# EAGLE design schema_mpb1_1_IO (EAGLE 9.0.1)

## Sheet 1 of 3: INPUTS
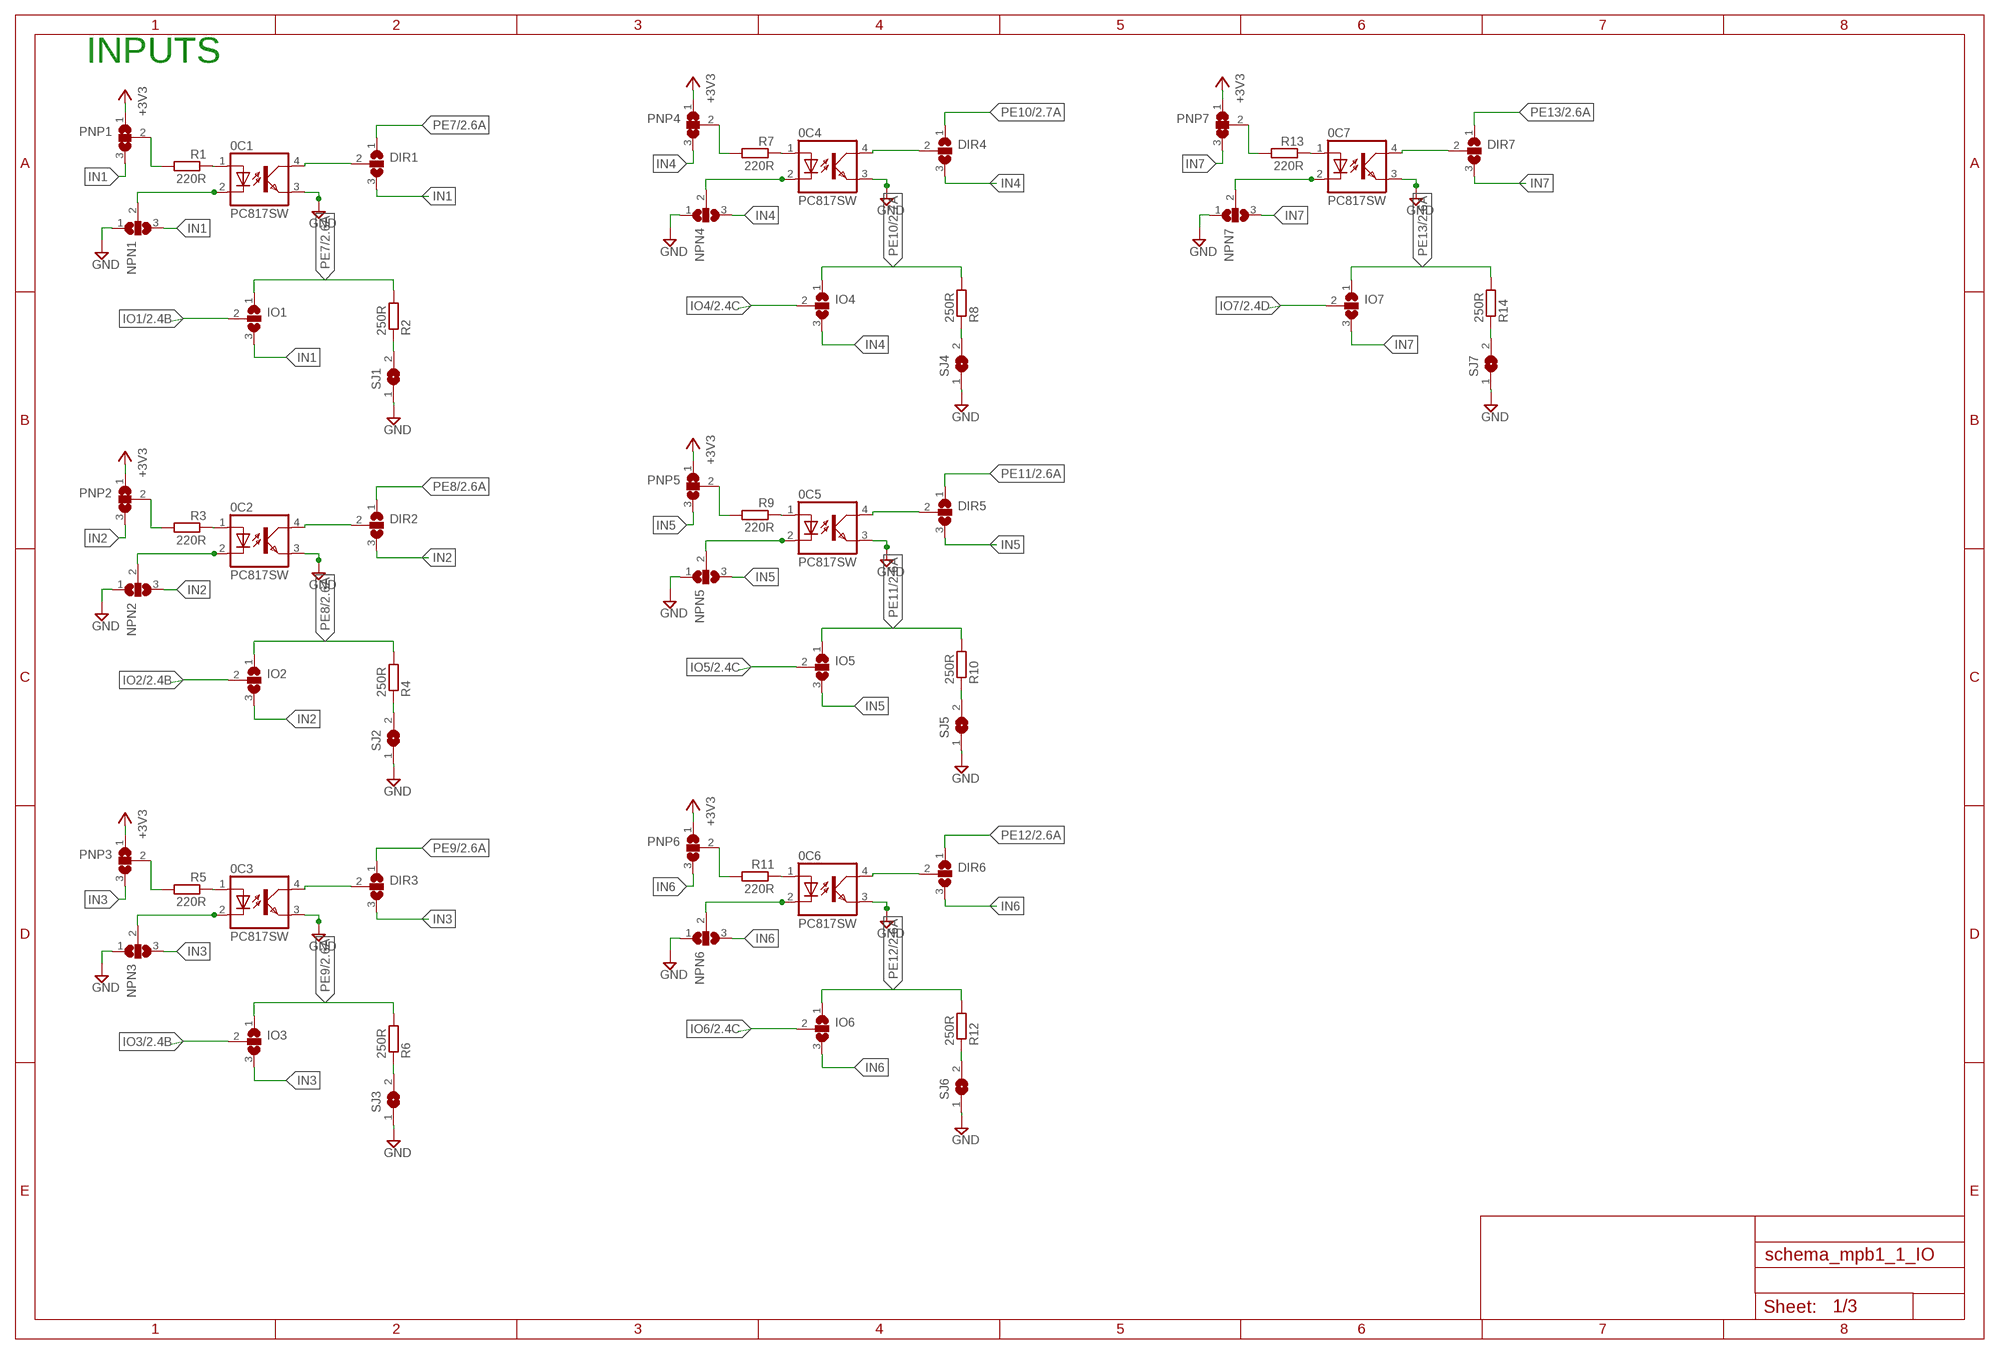
[diagram p0: schematic, sheet 1]

### Parts
0C1  PC817SW  [PC817SMTW]
0C2  PC817SW  [PC817SMTW]
0C3  PC817SW  [PC817SMTW]
0C4  PC817SW  [PC817SMTW]
0C5  PC817SW  [PC817SMTW]
0C6  PC817SW  [PC817SMTW]
0C7  PC817SW  [PC817SMTW]
DIR1  SJ2W  [SJ_2]
DIR2  SJ2W  [SJ_2]
DIR3  SJ2W  [SJ_2]
DIR4  SJ2W  [SJ_2]
DIR5  SJ2W  [SJ_2]
DIR6  SJ2W  [SJ_2]
DIR7  SJ2W  [SJ_2]
IO1  SJ2W  [SJ_2]
IO2  SJ2W  [SJ_2]
IO3  SJ2W  [SJ_2]
IO4  SJ2W  [SJ_2]
IO5  SJ2W  [SJ_2]
IO6  SJ2W  [SJ_2]
IO7  SJ2W  [SJ_2]
NPN1  SJ2W  [SJ_2]
NPN2  SJ2W  [SJ_2]
NPN3  SJ2W  [SJ_2]
NPN4  SJ2W  [SJ_2]
NPN5  SJ2W  [SJ_2]
NPN6  SJ2W  [SJ_2]
NPN7  SJ2W  [SJ_2]
PNP1  SJ2W  [SJ_2]
PNP2  SJ2W  [SJ_2]
PNP3  SJ2W  [SJ_2]
PNP4  SJ2W  [SJ_2]
PNP5  SJ2W  [SJ_2]
PNP6  SJ2W  [SJ_2]
PNP7  SJ2W  [SJ_2]
R1  220R  R-EU_R0603  [R0603]
R2  250R  R-EU_R0603  [R0603]
R3  220R  R-EU_R0603  [R0603]
R4  250R  R-EU_R0603  [R0603]
R5  220R  R-EU_R0603  [R0603]
R6  250R  R-EU_R0603  [R0603]
R7  220R  R-EU_R0603  [R0603]
R8  250R  R-EU_R0603  [R0603]
R9  220R  R-EU_R0603  [R0603]
R10  250R  R-EU_R0603  [R0603]
R11  220R  R-EU_R0603  [R0603]
R12  250R  R-EU_R0603  [R0603]
R13  220R  R-EU_R0603  [R0603]
R14  250R  R-EU_R0603  [R0603]
SJ1  SJ  [SJ]
SJ2  SJ  [SJ]
SJ3  SJ  [SJ]
SJ4  SJ  [SJ]
SJ5  SJ  [SJ]
SJ6  SJ  [SJ]
SJ7  SJ  [SJ]

### Nets
+3V3: PNP1.1 PNP2.1 PNP3.1 PNP4.1 PNP5.1 PNP6.1 PNP7.1 ; also sheet 2
GND: 0C1.3(EMIT) 0C2.3(EMIT) 0C3.3(EMIT) 0C4.3(EMIT) 0C5.3(EMIT) 0C6.3(EMIT) 0C7.3(EMIT) NPN1.1 NPN2.1 NPN3.1 NPN4.1 NPN5.1 NPN6.1 NPN7.1 SJ1.1 SJ2.1 SJ3.1 SJ4.1 SJ5.1 SJ6.1 SJ7.1 ; also sheet 2
IN1: DIR1.3 IO1.3 NPN1.3 PNP1.3
IN2: DIR2.3 IO2.3 NPN2.3 PNP2.3
IN3: DIR3.3 IO3.3 NPN3.3 PNP3.3
IN4: DIR4.3 IO4.3 NPN4.3 PNP4.3
IN5: DIR5.3 IO5.3 NPN5.3 PNP5.3
IN6: DIR6.3 IO6.3 NPN6.3 PNP6.3
IN7: DIR7.3 IO7.3 NPN7.3 PNP7.3
IO1: IO1.2 ; also sheet 2
IO2: IO2.2 ; also sheet 2
IO3: IO3.2 ; also sheet 2
IO4: IO4.2 ; also sheet 2
IO5: IO5.2 ; also sheet 2
IO6: IO6.2 ; also sheet 2
IO7: IO7.2 ; also sheet 2
N$1: PNP1.2 R1.2
N$2: R2.1 SJ1.2
N$3: PNP2.2 R3.2
N$4: 0C2.1(A) R3.1
N$5: 0C2.2(C) NPN2.2
N$6: 0C2.4(COL) DIR2.2
N$7: R4.1 SJ2.2
N$8: PNP3.2 R5.2
N$9: 0C3.1(A) R5.1
N$10: 0C3.2(C) NPN3.2
N$11: 0C3.4(COL) DIR3.2
N$12: R6.1 SJ3.2
N$13: PNP4.2 R7.2
N$14: 0C4.1(A) R7.1
N$15: 0C4.2(C) NPN4.2
N$16: 0C4.4(COL) DIR4.2
N$17: R8.1 SJ4.2
N$18: PNP5.2 R9.2
N$19: 0C5.1(A) R9.1
N$20: 0C5.2(C) NPN5.2
N$21: 0C5.4(COL) DIR5.2
N$22: R10.1 SJ5.2
N$23: PNP6.2 R11.2
N$24: 0C6.1(A) R11.1
N$25: 0C6.2(C) NPN6.2
N$26: 0C6.4(COL) DIR6.2
N$27: R12.1 SJ6.2
N$28: PNP7.2 R13.2
N$29: 0C7.1(A) R13.1
N$30: 0C7.2(C) NPN7.2
N$31: 0C1.1(A) R1.1
N$32: 0C7.4(COL) DIR7.2
N$33: 0C1.2(C) NPN1.2
N$34: R14.1 SJ7.2
N$47: 0C1.4(COL) DIR1.2
PE7: DIR1.1 IO1.1 R2.2 ; also sheet 2
PE8: DIR2.1 IO2.1 R4.2 ; also sheet 2
PE9: DIR3.1 IO3.1 R6.2 ; also sheet 2
PE10: DIR4.1 IO4.1 R8.2 ; also sheet 2
PE11: DIR5.1 IO5.1 R10.2 ; also sheet 2
PE12: DIR6.1 IO6.1 R12.2 ; also sheet 2
PE13: DIR7.1 IO7.1 R14.2 ; also sheet 2

### Notes on the sheet
- INPUTS

## Sheet 2 of 3: OUTPUTS
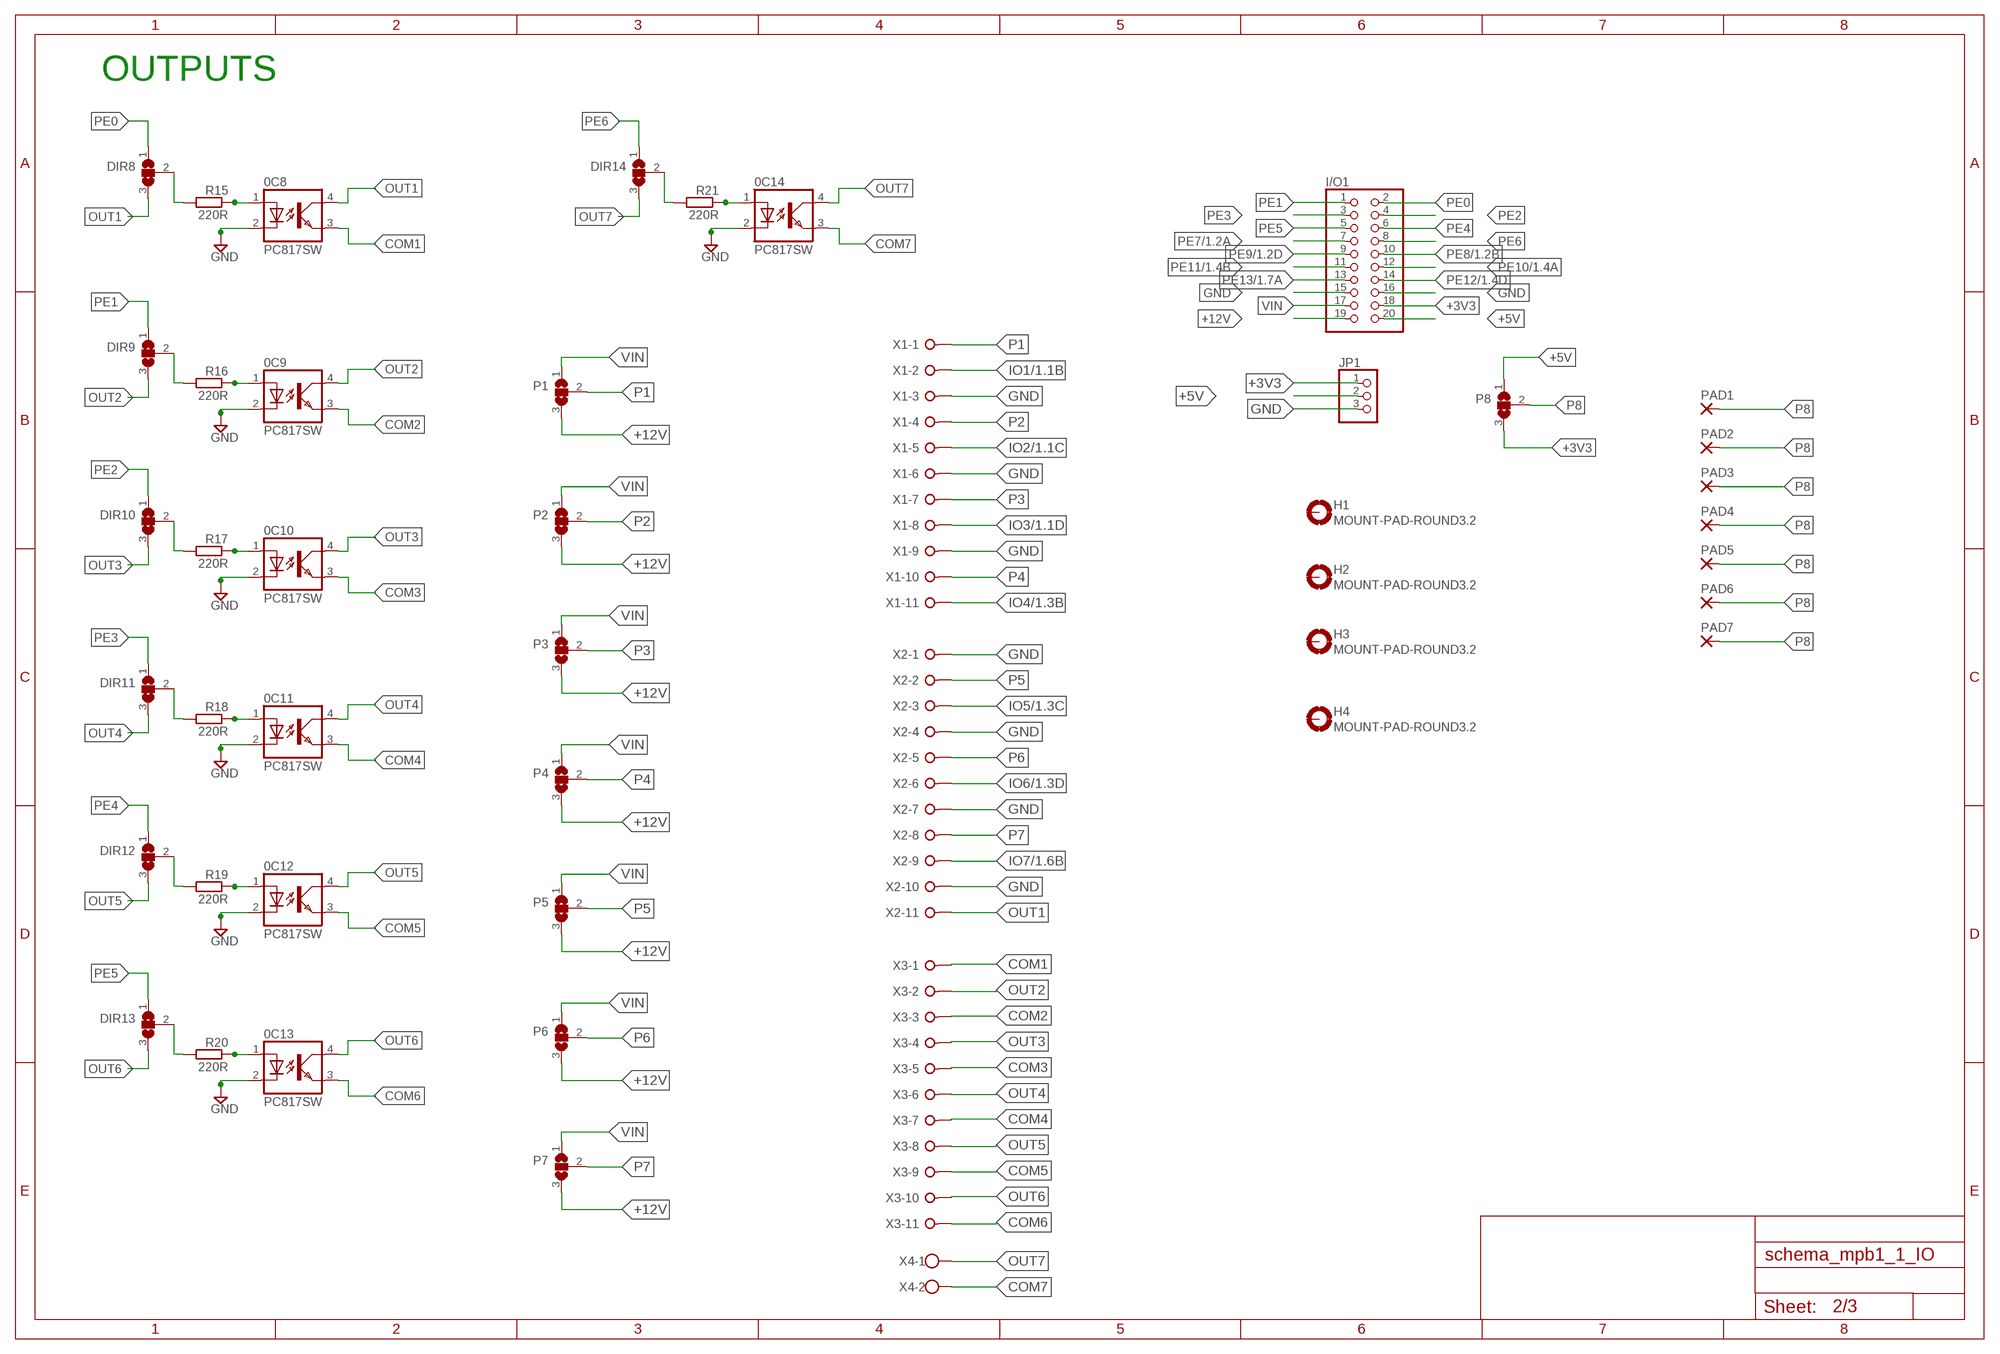
[diagram p1: schematic, sheet 2]

### Parts
0C8  PC817SW  [PC817SMTW]
0C9  PC817SW  [PC817SMTW]
0C10  PC817SW  [PC817SMTW]
0C11  PC817SW  [PC817SMTW]
0C12  PC817SW  [PC817SMTW]
0C13  PC817SW  [PC817SMTW]
0C14  PC817SW  [PC817SMTW]
DIR8  SJ2W  [SJ_2]
DIR9  SJ2W  [SJ_2]
DIR10  SJ2W  [SJ_2]
DIR11  SJ2W  [SJ_2]
DIR12  SJ2W  [SJ_2]
DIR13  SJ2W  [SJ_2]
DIR14  SJ2W  [SJ_2]
H1  MOUNT-PAD-ROUND3.2  [3,2-PAD]
H2  MOUNT-PAD-ROUND3.2  [3,2-PAD]
H3  MOUNT-PAD-ROUND3.2  [3,2-PAD]
H4  MOUNT-PAD-ROUND3.2  [3,2-PAD]
I/O1  PINHD-2X10_2.54  [2X10]
JP1  PINHD-1X3  [1X03]
P1  SJ2WW  [SJ_2W]
P2  SJ2WW  [SJ_2W]
P3  SJ2WW  [SJ_2W]
P4  SJ2WW  [SJ_2W]
P5  SJ2WW  [SJ_2W]
P6  SJ2WW  [SJ_2W]
P7  SJ2WW  [SJ_2W]
P8  SJ2WW  [SJ_2W]
PAD1  SMD2  [SMD1,27-2,54]
PAD2  SMD2  [SMD1,27-2,54]
PAD3  SMD2  [SMD1,27-2,54]
PAD4  SMD2  [SMD1,27-2,54]
PAD5  SMD2  [SMD1,27-2,54]
PAD6  SMD2  [SMD1,27-2,54]
PAD7  SMD2  [SMD1,27-2,54]
R15  220R  R-EU_R0603  [R0603]
R16  220R  R-EU_R0603  [R0603]
R17  220R  R-EU_R0603  [R0603]
R18  220R  R-EU_R0603  [R0603]
R19  220R  R-EU_R0603  [R0603]
R20  220R  R-EU_R0603  [R0603]
R21  220R  R-EU_R0603  [R0603]
X1  W237-11P  [W237-11P]
X2  W237-11P  [W237-11P]
X3  W237-11P  [W237-11P]
X4  W237-102  [W237-102]

### Nets
+3V3: I/O1.18 JP1.1 P8.3 ; also sheet 1
+5V: I/O1.20 JP1.2 P8.1
+12V: I/O1.19 P1.3 P2.3 P3.3 P4.3 P5.3 P6.3 P7.3
COM1: 0C8.3(EMIT) X3.1
COM2: 0C9.3(EMIT) X3.3
COM3: 0C10.3(EMIT) X3.5
COM4: 0C11.3(EMIT) X3.7
COM5: 0C12.3(EMIT) X3.9
COM6: 0C13.3(EMIT) X3.11
COM7: 0C14.3(EMIT) X4.2
GND: 0C8.2(C) 0C9.2(C) 0C10.2(C) 0C11.2(C) 0C12.2(C) 0C13.2(C) 0C14.2(C) I/O1.15 I/O1.16 JP1.3 X1.3 X1.6 X1.9 X2.1 X2.4 X2.7 X2.10 ; also sheet 1
IO1: X1.2 ; also sheet 1
IO2: X1.5 ; also sheet 1
IO3: X1.8 ; also sheet 1
IO4: X1.11 ; also sheet 1
IO5: X2.3 ; also sheet 1
IO6: X2.6 ; also sheet 1
IO7: X2.9 ; also sheet 1
N$35: DIR14.2 R21.2
N$36: 0C9.1(A) R16.1
N$37: DIR9.2 R16.2
N$38: 0C10.1(A) R17.1
N$39: DIR10.2 R17.2
N$40: 0C11.1(A) R18.1
N$41: DIR11.2 R18.2
N$42: 0C12.1(A) R19.1
N$43: DIR12.2 R19.2
N$44: 0C13.1(A) R20.1
N$45: DIR13.2 R20.2
N$46: 0C14.1(A) R21.1
N$59: DIR8.2 R15.2
N$60: 0C8.1(A) R15.1
OUT1: 0C8.4(COL) DIR8.3 X2.11
OUT2: 0C9.4(COL) DIR9.3 X3.2
OUT3: 0C10.4(COL) DIR10.3 X3.4
OUT4: 0C11.4(COL) DIR11.3 X3.6
OUT5: 0C12.4(COL) DIR12.3 X3.8
OUT6: 0C13.4(COL) DIR13.3 X3.10
OUT7: 0C14.4(COL) DIR14.3 X4.1
P1: P1.2 X1.1
P2: P2.2 X1.4
P3: P3.2 X1.7
P4: P4.2 X1.10
P5: P5.2 X2.2
P6: P6.2 X2.5
P7: P7.2 X2.8
P8: P8.2 PAD1.1(P) PAD2.1(P) PAD3.1(P) PAD4.1(P) PAD5.1(P) PAD6.1(P) PAD7.1(P)
PE0: DIR8.1 I/O1.2
PE1: DIR9.1 I/O1.1
PE2: DIR10.1 I/O1.4
PE3: DIR11.1 I/O1.3
PE4: DIR12.1 I/O1.6
PE5: DIR13.1 I/O1.5
PE6: DIR14.1 I/O1.8
PE7: I/O1.7 ; also sheet 1
PE8: I/O1.10 ; also sheet 1
PE9: I/O1.9 ; also sheet 1
PE10: I/O1.12 ; also sheet 1
PE11: I/O1.11 ; also sheet 1
PE12: I/O1.14 ; also sheet 1
PE13: I/O1.13 ; also sheet 1
VIN [power]: I/O1.17 P1.1 P2.1 P3.1 P4.1 P5.1 P6.1 P7.1
Unconnected: H1.B3,2(MOUNT) H2.B3,2(MOUNT) H3.B3,2(MOUNT) H4.B3,2(MOUNT)

### Notes on the sheet
- OUTPUTS

## Sheet 3 of 3

## Library data of the parts
0C1-0C14 = GadgetFactory_v1:PC817
DIR1-DIR14 IO1-IO7 NPN1-NPN7 P1-P8 PNP1-PNP7 = jumper:SJ2W: SMD solder JUMPER
H1-H4 = holes:MOUNT-PAD-ROUND: MOUNTING PAD, round
I/O1 = pinhead-2:PINHD-2X10: PIN HEADER
JP1 = pinhead:PINHD-1X3: PIN HEADER
PAD1-PAD7 = wirepad:SMD2: SMD PAD
R1-R21 = rcl:R-EU_: RESISTOR, European symbol; SPICEPREFIX: R
SJ1-SJ7 = jumper:SJ: SMD solder JUMPER
X1-X3 = con-wago-508:W237-11P: WAGO SREW CLAMP; OC_FARNELL: unknown; OC_NEWARK: unknown
X4 = con-wago-500:W237-102: WAGO SCREW CLAMP; MPN: 237-102; OC_FARNELL: unknown; OC_NEWARK: 70K9898

## Net classes
1 power: width 0.152 mm, drill 0.152 mm, clearance 0.152 mm
2 gnd: width 0.152 mm, drill 0.152 mm, clearance 0.152 mm
3 power usb: width 0.152 mm, drill 0.152 mm, clearance 0.152 mm

## Board
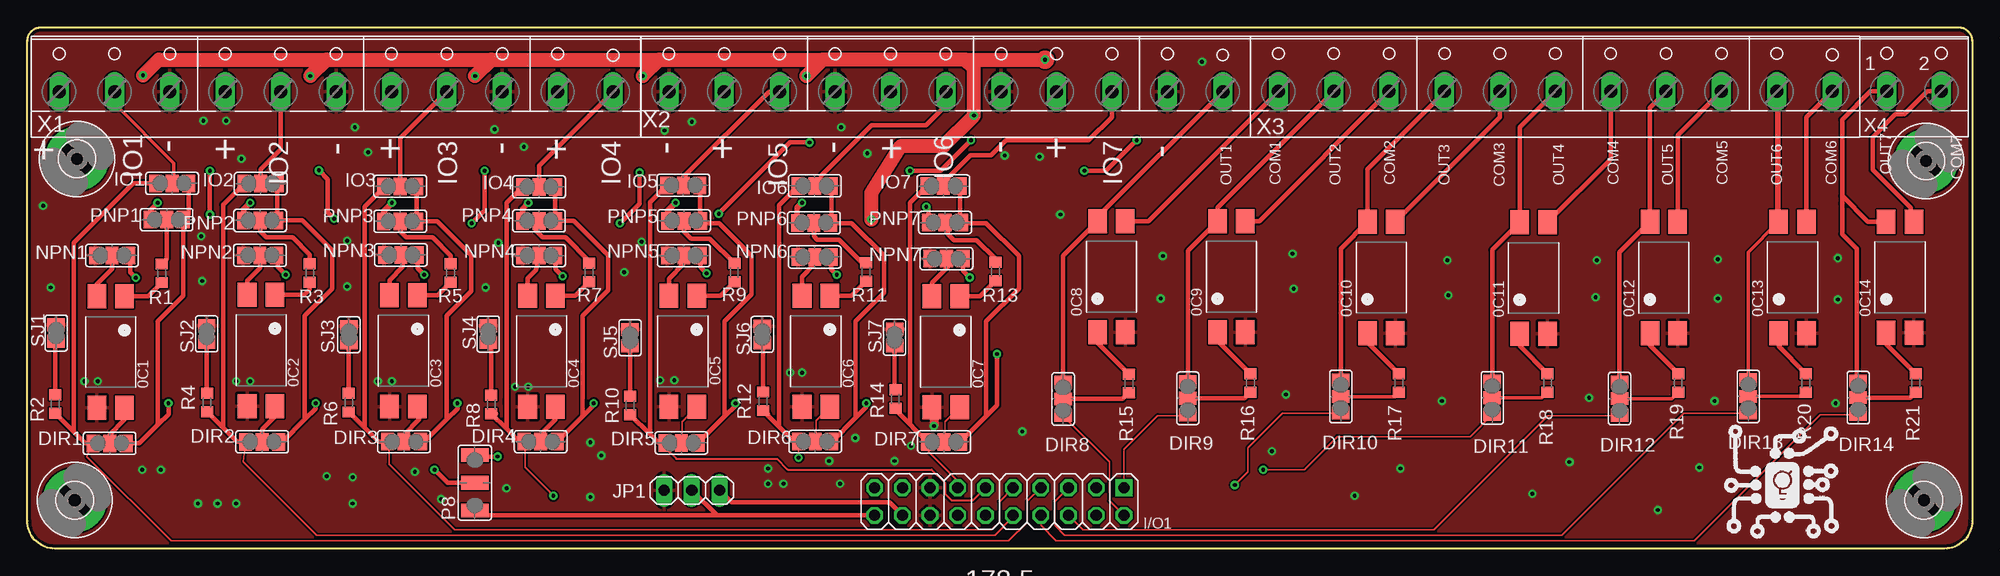
[diagram p2: board, top side]
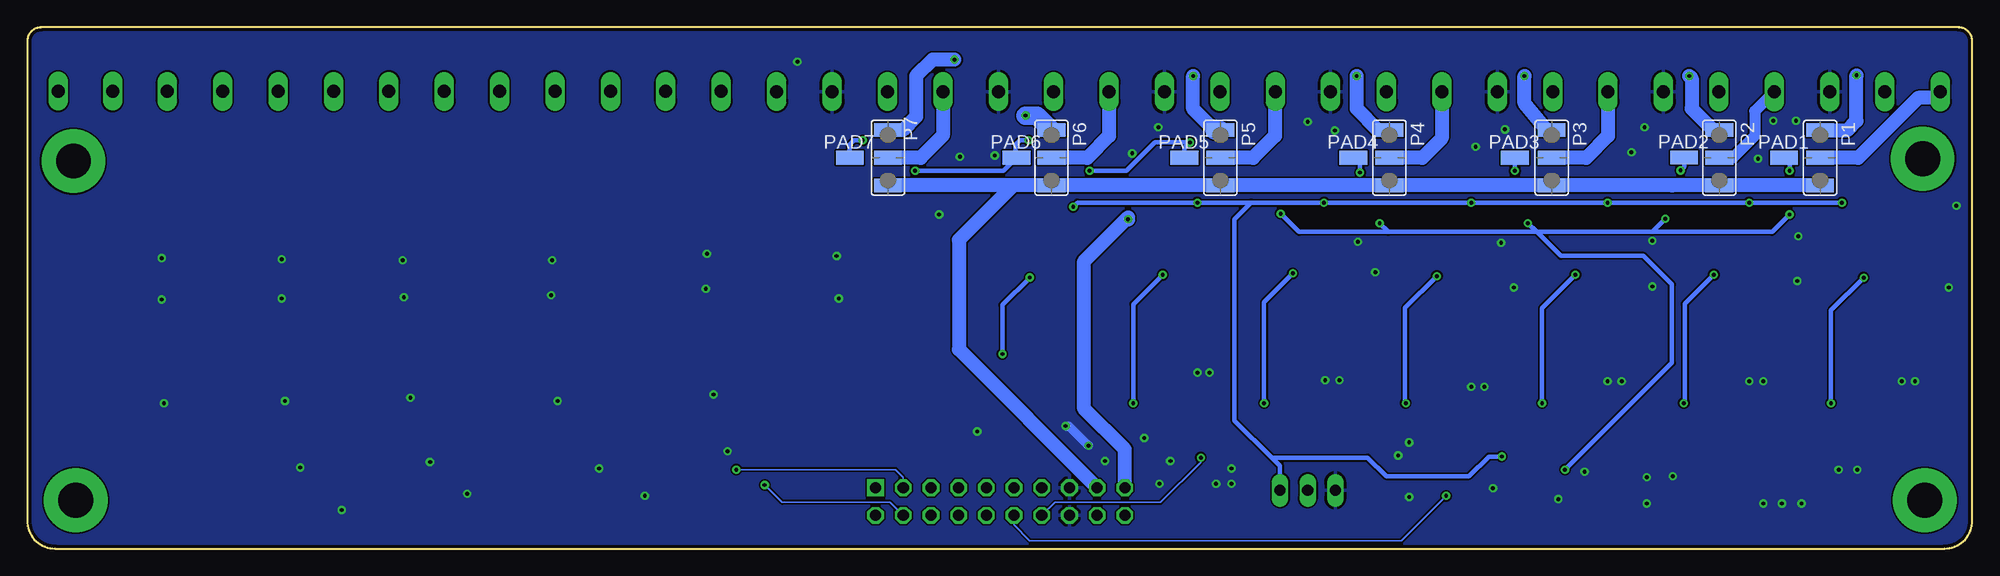
[diagram p3: board, bottom side, seen from below]

Size 178.39 x 47.8 mm. Coordinates in mm from the lower left corner, seen from the top.
Outline: 175.85,0 2.54,0 arc-90 0,2.54 0,46.53 arc-90 1.27,47.8 177.12,47.8 arc-90 178.39,46.53 178.39,2.54 arc-90 175.85,0
Copper layers (1*16): Top 0.035mm / dielectric 1.5mm / Bottom 0.035mm
Design rules "default *": minimum track width 6mil, minimum drill 0.35mm, track to track 6mil, track to pad 6mil, pad to pad 6mil, via to via 6mil, smd to smd 6mil, copper to edge 10mil, drill to drill 6mil, minimum pad ring 10mil, minimum via ring 8mil, stop-mask expansion 4mil, vias tented up to drill 0mil, thermal gap 10mil

### Footprints (pad centres in the part's own frame; a part is rotated, then mirrored left to right if it is on the bottom)
PC817SMTW = smd 1.7 x 2.2: 1 -1.27,-5.1; 2 1.27,-5.1; 3 1.27,5.1; 4 -1.27,5.1
SJ_2 = smd 1.168 x 1.6: 1 -1.524,0; 2 0,0; 3 1.524,0
3,2-PAD = drill 3.2 pad 5.842: B3,2 0,0
2X10 = drill 1.016 square: 1 -11.43,-1.27 | drill 1.016 octagon: 2 -11.43,1.27; 3 -8.89,-1.27; 4 -8.89,1.27; 5 -6.35,-1.27; 6 -6.35,1.27; 7 -3.81,-1.27; 8 -3.81,1.27; 9 -1.27,-1.27; 10 -1.27,1.27; 11 1.27,-1.27; 12 1.27,1.27; 13 3.81,-1.27; 14 3.81,1.27; 15 6.35,-1.27; 16 6.35,1.27; 17 8.89,-1.27; 18 8.89,1.27; 19 11.43,-1.27; 20 11.43,1.27
1X03 = drill 1.016 long: 1 -2.54,0; 2 0,0; 3 2.54,0
SJ_2W = smd 1.27 x 2.54: 1 -2.54,0; 2 0,0; 3 2.54,0
SMD1,27-2,54 = smd 1.27 x 2.54: 1 0,0
R0603 = smd 1 x 1.1: 1 -0.85,0; 2 0.85,0
SJ = smd 1.168 x 1.6: 1 -0.762,0; 2 0.762,0
W237-11P = drill 1.194 long: 1 -25.4,-0.635; 2 -20.32,-0.635; 3 -15.24,-0.635; 4 -10.16,-0.635; 5 -5.08,-0.635; 6 0,-0.635; 7 5.08,-0.635; 8 10.16,-0.635; 9 15.24,-0.635; 10 20.32,-0.635; 11 25.4,-0.635
W237-102 = drill 1.194 long: 1 -2.5,-1.27; 2 2.5,-1.27

### Placement (x,y rotation side)
0C1  7.64,18.03 180 top
0C2  21.44,18.17 180 top
0C3  34.51,18.13 180 top
0C4  47.16,18.09 180 top
0C5  60.13,18.09 180 top
0C6  72.33,18.09 180 top
0C7  84.24,18.05 180 top
0C8  99.44,24.91 0 top
0C9  110.44,24.91 0 top
0C10  124.19,24.85 0 top
0C11  138.15,24.8 0 top
0C12  150.1,24.84 0 top
0C13  161.91,24.86 0 top
0C14  171.77,24.87 0 top
DIR1  7.56,9.65 0 top
DIR2  21.54,9.79 0 top
DIR3  34.55,9.8 0 top
DIR4  47.09,9.8 0 top
DIR5  60,9.68 0 top
DIR6  72.27,9.81 0 top
DIR7  84.09,9.78 0 top
DIR8  95.01,13.71 90 top
DIR9  106.45,13.78 90 top
DIR10  120.47,13.94 90 top
DIR11  134.37,13.82 90 top
DIR12  146.04,13.75 90 top
DIR13  157.84,13.95 90 top
DIR14  167.93,13.84 90 top
H1  4.35,4.43 0 top
H2  173.95,4.43 0 top
H3  4.55,35.73 0 top
H4  174.15,35.53 0 top
I/O1  89.15,4.31 180 top
IO1  13.29,33.49 0 top
IO2  21.41,33.47 0 top
IO3  34.21,33.22 0 top
IO4  46.94,33.17 0 top
IO5  60.17,33.31 0 top
IO6  72.23,33.25 0 top
IO7  84.02,33.24 0 top
JP1  60.95,5.33 180 top
NPN1  7.78,26.88 0 top
NPN2  21.35,26.89 0 top
NPN3  34.27,26.92 0 top
NPN4  46.95,26.86 0 top
NPN5  60.22,26.86 0 top
NPN6  72.22,26.74 0 top
NPN7  84.31,26.58 0 top
P1  13.95,35.83 90 bottom
P2  23.2,35.83 90 bottom
P3  38.57,35.83 90 bottom
P4  53.45,35.83 90 bottom
P5  68.95,35.83 90 bottom
P6  84.45,35.83 90 bottom
P7  99.45,35.83 90 bottom
P8  41.05,6.03 90 top
PAD1  17.25,35.83 270 bottom
PAD2  26.43,35.86 270 bottom
PAD3  41.95,35.83 270 bottom
PAD4  56.75,35.83 270 bottom
PAD5  72.25,35.83 270 bottom
PAD6  87.65,35.83 270 bottom
PAD7  102.95,35.83 270 bottom
PNP1  12.78,30.16 0 top
PNP2  21.36,30.08 0 top
PNP3  34.21,30.01 0 top
PNP4  46.94,30.05 0 top
PNP5  60.24,30.05 0 top
PNP6  72.15,29.87 0 top
PNP7  84.18,29.89 0 top
R1  12.34,25.25 90 top
R2  2.57,13.26 270 top
R3  25.92,25.27 90 top
R4  16.48,13.4 270 top
R5  38.84,25.28 90 top
R6  29.5,13.37 270 top
R7  51.52,25.32 90 top
R8  42.56,13.22 270 top
R9  64.86,25.3 90 top
R10  55.3,13.12 270 top
R11  76.93,25.37 90 top
R12  67.48,13.51 270 top
R13  88.8,25.41 90 top
R14  79.62,13.73 270 top
R15  101.06,15.15 270 top
R16  112.19,15.19 270 top
R17  125.82,15.19 270 top
R18  139.44,15.19 270 top
R19  151.41,15.19 270 top
R20  163.13,15.19 270 top
R21  173.2,15.19 270 top
SJ1  2.65,19.76 270 top
SJ2  16.46,19.68 270 top
SJ3  29.5,19.6 270 top
SJ4  42.28,19.67 270 top
SJ5  55.28,19.33 270 top
SJ6  67.41,19.63 270 top
SJ7  79.55,19.36 270 top
X1  28.33,42.52 0 top
X2  84.25,42.54 0 top
X3  140.15,42.55 0 top
X4  173.05,43.21 0 top

### Tracks (layer width: path | path; a pad name or v marks a point on that pad's centre or on a via)
+3V3  (via drill 0.35)
  Top 0.406: v82.45,31.33 82.66,31.13 PNP7.1 | JP1.1 64.59,4.23 79.07,4.23 I/O1.18 | PNP1.1 11.26,31.02 v11.95,31.71 | P8.3 41.19,8.43 v43.15,8.43
  Top 0.508: PNP6.1 70.63,31.26 v71.07,31.71 | PNP5.1 58.72,30.97 v59.45,31.71 | PNP4.1 45.42,31.17 v45.95,31.71 | PNP3.1 32.68,30.94 v33.45,31.71 | PNP2.1 19.84,31.09 v20.45,31.71
  Bottom 0.406: v82.45,31.33 82.08,31.71 v71.07,31.71 66.15,31.71 | 66.15,31.71 v59.45,31.71 v45.95,31.71 v33.45,31.71 v20.45,31.71 v11.95,31.71 | v43.15,8.43 44.35,8.43 46.15,6.63 53.75,6.63 55.45,8.33 64.25,8.33 | 64.25,8.33 67.65,11.73 67.65,30.21 66.15,31.71 | 64.25,8.33 63.49,7.57 JP1.1
+5V
  Top 0.406: JP1.2 63.25,3.04 67.15,3.04 | 67.15,3.04 I/O1.20 | 67.15,3.04 67.15,3.03 41.51,3.03 P8.1
+12V  (via drill 0.35)
  Top 1.3: v77.42,30.2 77.42,32.6 80.15,36.93 84.05,36.93 v86.82,39.7 86.82,44.03 86.02,44.83 | 86.02,44.83 72.95,44.83 | v71.45,43.33 72.95,44.83 | v25.95,43.33 27.45,44.83 | 27.45,44.83 42.57,44.83 | 42.57,44.83 57.95,44.83 | 57.95,44.83 72.95,44.83 | v10.62,43.4 12.06,44.83 27.45,44.83 | 86.02,44.83 v93.35,44.83 | v41.07,43.33 42.57,44.83 | v56.45,43.33 57.95,44.83
  Top 1.7: v93.35,44.83
  Bottom 1.3: I/O1.19 77.72,9.11 81.45,12.83 81.45,26.33 77.42,30.36 v77.42,30.2 | v71.45,43.33 71.45,40.33 69.49,38.37 | P4.3 54.49,38.37 56.45,40.33 v56.45,43.33 | P3.3 38.99,38.37 41.07,40.83 v41.07,43.33 | P2.3 23.76,38.37 25.73,40.35 25.73,43.12 v25.95,43.33 | v93.35,44.83 95.35,44.83 96.85,43.33 96.85,39.6 98.07,38.37 P7.3 | P1.3 11.45,38.37 10.62,39.21 v10.62,43.4
  Bottom 1.7: P5.3 69.49,38.37 | P6.3 85.78,39.7 v86.82,39.7
COM1
  Top 0.41: 0C8.3 102.84,30.01 X3.1
COM2
  Top 0.41: 0C9.3 113,30.01 X3.3
COM3
  Top 0.305: 135.07,41.83 X3.5
  Top 0.41: 0C10.3 135.07,39.56 135.07,41.83
COM4
  Top 0.41: X3.7 145.23,35.71 0C11.3
COM5
  Top 0.41: X3.9 151.37,37.9 0C12.3
COM6
  Top 0.41: X3.11 163.18,39.55 0C13.3
COM7
  Top 0.254: 172.15,39.83 171.95,39.83
  Top 0.41: X4.2 174.26,41.94 172.15,39.83 | 171.95,39.83 171.35,39.83 169.25,37.73 169.25,34.73 172.75,31.23 172.75,30.25 0C14.3
GND  (via drill 0.35)
  Top 0.152: NPN2.1 19.84,26.88 19.84,27.03
  Top 0.305: 0C1.3 6.45,13.01 | 0C2.3 20.45,13.35 | 0C4.3 45.95,13.04 | v83.15,11.23 83.07,11.32
  Top 0.813: 0C6.3 71.06,12.44 | 0C7.3 83.15,12.77 v83.15,11.23
  Bottom 0.813: v81.05,9.43 82.85,11.23 v83.15,11.23
  other vias: 6.45,15.33 20.45,15.33 33.45,15.33 45.95,14.83 59.35,15.43 71.05,16.13 69.95,16.13 67.95,5.93 67.95,7.33 69.35,5.93 73.55,8.03 74.55,5.93 51.65,9.73 52.65,8.53 51.65,4.73 35.55,7.03 43.95,5.53 37.95,4.53 79.55,8.03 75.95,10.13 27.45,6.63 29.85,6.53 29.85,4.13 19.15,4.13 17.45,4.13 15.65,4.13 10.55,7.23 12.25,7.23 116.05,27.03 116.15,23.83 130.25,26.43 130.35,23.23 143.95,26.43 143.85,23.03 155.05,26.53 155.05,22.93 166.05,26.63 166.05,22.83 104.15,26.83 103.95,22.93 129.75,13.53 143.25,13.83 154.75,13.53 165.85,13.33 114.15,8.93 115.45,14.13 121.75,4.83 138.05,5.03 141.45,7.93 149.55,3.53 153.35,7.43 125.95,7.33 2.15,23.93 1.45,31.43 19.65,35.73 18.25,39.23 30.05,38.63 31.25,36.33 42.85,38.43 45.55,36.83 58.45,38.33 60.95,39.13 77.05,36.23 74.65,38.63 16.15,39.23 89.65,36.03 92.85,35.93 107.75,44.63 56.35,28.13 54.75,25.33 43.21,28.03 42.05,23.93 29.35,24.03 29.35,28.23 16.05,24.53 15.95,28.63 94.75,30.63 91.25,10.73 5.25,15.33 19.15,15.33 32.15,15.33 44.75,14.83 58.05,15.43
  pour Top: 175.47,0.21 2.75,0.21 arc-90 0.21,2.75 0.21,46.3 arc-90 1.48,47.57 176.74,47.57 arc-90 178.01,46.3 178.01,2.75 arc-90
  pour Bottom: 175.47,0.33 2.75,0.33 arc-90 0.21,2.87 0.21,46.3 arc-90 1.48,47.57 176.74,47.57 arc-90 178.01,46.3 178.01,2.87 arc-90
IN1  (via drill 0.35)
  Top 0.406: 11.95,11.33 11.95,20.83 14.31,23.19 PNP1.3 14.81,30.66 IO1.3 | 11.95,11.33 10.26,9.65 DIR1.3 | NPN1.3 9.45,26.73 9.45,25.33 v9.95,24.83 | v12.95,13.33 12.95,12.33 11.95,11.33
  Bottom 0.406: v9.95,24.83 12.95,21.83 v12.95,13.33
IN2  (via drill 0.35)
  Top 0.406: 25.45,11.83 25.45,21.33 27.95,23.83 27.95,27.33 25.21,30.08 PNP2.3 22.94,30.13 IO2.3 | 25.45,11.83 23.41,9.79 DIR2.3 | NPN2.3 22.95,26.81 22.95,25.83 23.68,25.11 v23.7,25.11 | v26.45,13.33 26.45,12.83 25.45,11.83
  Bottom 0.406: v23.7,25.11 26.37,22.44 26.37,13.42 v26.45,13.33
IN3  (via drill 0.35)
  Top 0.406: IO3.3 PNP3.3 37.6,30.01 40.72,26.88 40.72,23.6 38.45,21.33 38.45,11.83 | 38.45,11.83 36.42,9.8 DIR3.3 | NPN3.3 35.79,25.71 v36.4,25.11 | 38.45,11.83 39.45,12.83 v39.45,13.33
  Bottom 0.406: v36.4,25.11 39.45,22.06 v39.45,13.33
IN4  (via drill 0.35)
  Top 0.406: IO4.3 48.43,32.84 48.43,30.09 PNP4.3 50.12,30.05 53.29,26.88 53.29,23.67 50.95,21.33 50.95,12.14 | 50.95,12.14 DIR4.3 | NPN4.3 48.47,25.61 v49.1,24.98 | 50.95,12.14 51.95,13.14 v51.95,13.33
  Bottom 0.406: v49.1,24.98 52.02,22.06 52.02,13.4 v51.95,13.33
IN5  (via drill 0.35)
  Top 0.406: 63.95,12.11 DIR5.3 | 63.95,12.11 63.95,20.83 66.45,23.33 66.45,26.83 63.45,29.83 61.98,29.83 PNP5.3 61.7,30.12 IO5.3 | NPN5.3 61.74,25.8 v62.31,25.23 | 63.95,12.11 64.95,13.11 v64.95,13.33
  Bottom 0.406: v62.31,25.23 64.95,22.59 v64.95,13.33
IN6  (via drill 0.35)
  Top 0.406: PNP6.3 73.71,29.83 73.95,29.83 | 75.95,11.97 DIR6.3 | 73.95,29.83 75.62,29.83 78.57,26.88 78.57,23.45 75.95,20.83 75.95,11.97 | NPN6.3 73.74,25.61 v74.25,25.11 | 75.95,11.97 76.95,12.97 v76.95,13.33 | IO6.3 73.75,30.03 73.95,29.83
  Bottom 0.406: v74.25,25.11 76.95,22.4 v76.95,13.33
IN7  (via drill 0.35)
  Top 0.406: IO7.3 85.55,30.05 PNP7.3 85.76,29.83 87.95,29.83 90.95,26.83 90.95,23.83 87.95,20.83 87.95,12.12 | 87.95,12.12 DIR7.3 | NPN7.3 85.83,25.46 v86.44,24.85 | v88.95,17.83 88.95,13.12 87.95,12.12
  Bottom 0.406: v86.44,24.85 88.95,22.34 v88.95,17.83
IO1
  Top 0.305: X1.2 8.01,40.78 13.45,35.33 13.45,33.65 IO1.2
IO2
  Top 0.406: X1.5 23.25,36.63 21.41,34.79 IO2.2
IO3
  Top 0.406: X1.8 34.21,37.61 IO3.2
IO4
  Top 0.406: X1.11 46.94,35.11 IO4.2
IO5
  Top 0.406: IO5.2 60.17,34.05 68.02,41.9 X2.3
IO6
  Top 0.406: IO6.2 72.81,33.84 72.81,34.2 77.44,38.83 82.45,38.83 84.25,40.63 X2.6
IO7
  Top 0.406: X2.9 99.49,39.57 97.35,37.43 89.75,37.43 88.4,36.08 86.5,36.08 84.03,33.6 IO7.2
N$1
  Top 0.406: PNP1.2 12.78,26.54 R1.2
N$2
  Top 0.406: SJ1.2 2.57,18.91 R2.1
N$3
  Top 0.406: PNP2.2 21.36,29.1 21.92,28.54 24.34,28.54 25.92,26.96 R3.2
N$4
  Top 0.406: R3.1 25.92,23.8 25.39,23.27 0C2.1
N$5
  Top 0.406: 0C2.2 20.17,24.55 21.35,25.73 NPN2.2
N$6
  Top 0.406: DIR2.2 21.54,10.92 22.71,12.09 0C2.4
N$7
  Top 0.406: SJ2.2 16.46,14.28 R4.1
N$8
  Top 0.406: 34.37,29.85 PNP3.2 34.21,29.08 34.75,28.54 37.16,28.54 38.84,26.86 R5.2
N$9
  Top 0.406: R5.1 37.64,23.23 0C3.1
N$10
  Top 0.406: 0C3.2 33.24,24.62 34.45,25.83 34.45,26.74 NPN3.2
N$11
  Top 0.406: DIR3.2 34.55,10.44 35.95,11.83 35.95,12.85 0C3.4
N$12
  Top 0.406: SJ3.2 R6.1
N$13
  Top 0.406: PNP4.2 46.56,29.23 47.25,28.54 49.36,28.54 51.52,26.37 R7.2
N$14
  Top 0.406: R7.1 50.24,23.18 0C4.1
N$15
  Top 0.406: NPN4.2 46.69,25.57 45.89,24.77 0C4.2
N$16
  Top 0.406: DIR4.2 47.09,10.47 48.45,11.83 48.45,12.97 0C4.4
N$17
  Top 0.406: SJ4.2 42.56,18.62 R8.1
N$18
  Top 0.406: PNP5.2 60.24,29.05 60.88,28.41 62.6,28.41 R9.2
N$19
  Top 0.406: 0C5.1 63.6,23.19 R9.1
N$20
  Top 0.406: 0C5.2 58.86,24.74 60.22,26.1 NPN5.2
N$21
  Top 0.152: DIR5.2 60.07,9.74 60.07,11.64 61.37,12.94 0C5.4
N$22
  Top 0.406: SJ5.2 55.28,13.98 R10.1
N$23
  Top 0.406: PNP6.2 72.15,28.64 72.45,28.33 74.45,28.33 76.56,26.22 R11.2
N$24
  Top 0.406: 0C6.1 75.6,23.19 R11.1
N$25
  Top 0.406: 0C6.2 71.06,24.94 72.22,26.1 NPN6.2
N$26
  Top 0.152: DIR6.2 72.34,9.82 72.34,11.72 73.56,12.94 0C6.4
N$27
  Top 0.406: R12.1 67.48,18.67 SJ6.2
N$28
  Top 0.406: PNP7.2 84.45,29.62 84.45,28.83 85,28.28 87.07,28.28 88.8,26.56 R13.2
N$29
  Top 0.406: 0C7.1 87.39,23.15 R13.1
N$30
  Top 0.406: 0C7.2 82.97,24.35 84.45,25.83 84.45,26.44 NPN7.2
N$31
  Top 0.406: 0C1.1 11.08,23.13 R1.1
N$32
  Top 0.152: DIR7.2 84.15,9.82 84.15,11.64 85.45,12.94 0C7.4
N$33
  Top 0.406: 0C1.2 6.37,24.26 7.78,25.66 NPN1.2
N$34
  Top 0.406: SJ7.2 79.55,14.65 R14.1
N$35
  Top 0.41: DIR14.2 172.7,13.84 R21.2
N$36
  Top 0.41: 0C9.1 109.17,19.06 R16.1
N$37
  Top 0.41: DIR9.2 111.63,13.78 R16.2
N$38
  Top 0.41: 0C10.1 122.92,18.93 R17.1
N$39
  Top 0.305: DIR10.2 125.42,13.94 R17.2
N$40
  Top 0.305: 0C11.1 136.89,18.59
  Top 0.41: 136.89,18.59 R18.1
N$41
  Top 0.305: R18.2 138.92,13.82 DIR11.2
N$42
  Top 0.41: 0C12.1 148.83,18.62 R19.1
N$43
  Top 0.305: R19.2 150.83,13.75 DIR12.2
N$44
  Top 0.305: 163.04,16.13 R20.1
  Top 0.41: 0C13.1 160.64,18.53 163.04,16.13
N$45
  Top 0.305: R20.2 162.74,13.95 DIR13.2
N$46
  Top 0.305: 170.5,19.63 0C14.1
  Top 0.41: R21.1 170.5,18.74 170.5,19.63
N$47
  Top 0.406: DIR1.2 7.56,10.44 8.91,11.8 0C1.4
N$59
  Top 0.41: DIR8.2 100.47,13.71 R15.2
N$60
  Top 0.41: 0C8.1 98.17,18.89 R15.1
OUT1
  Top 0.41: X2.11 98.17,30.42 0C8.4 95.01,26.86 DIR8.3
OUT2
  Top 0.41: X3.2 109.17,31.26 0C9.4 106.45,27.29 DIR9.3
OUT3
  Top 0.305: 129.99,41.83 X3.4
  Top 0.41: DIR10.3 120.47,27.5 0C10.4 122.92,34.77 129.99,41.83
OUT4
  Top 0.305: 134.37,15.43 DIR11.3 | 139.91,41.68 X3.6
  Top 0.41: 139.91,41.68 136.89,38.65 0C11.4 134.37,27.38 134.37,15.43
OUT5
  Top 0.41: X3.8 148.83,40.44 0C12.4 146.04,27.16 DIR12.3
OUT6
  Top 0.305: DIR13.3 157.84,27.17 160.53,29.86 0C13.4 160.64,41.75 X3.10
  Top 0.41: X3.10 160.53,41.85 160.53,29.86
OUT7
  Top 0.254: 166.45,39.33 166.45,32.33 166.45,31.63 | 167.81,15.49 DIR14.3
  Top 0.41: X4.1 169.06,41.94 166.45,39.33 166.45,31.63 166.45,28.83 167.81,27.48 167.81,15.49 | 166.45,32.33 168.82,29.97 0C14.4
P1
  Bottom 1.27: P1.2 10.45,35.83 4.95,41.33 3.48,41.33 X1.1
P2
  Bottom 1.016: X1.4 19.95,40.1 19.95,37.83 21.95,35.83 P2.2
P3
  Bottom 1.27: X1.7 33.41,37.83 35.41,35.83 P3.2
P4
  Bottom 1.27: X1.10 48.65,37.64 50.45,35.83 P4.2
P5
  Bottom 1.27: X2.2 63.95,41.88 63.95,37.83 65.95,35.83 P5.2
P6
  Bottom 1.27: X2.5 79.17,37.83 81.17,35.83 P6.2
P7
  Bottom 1.27: X2.8 94.41,37.88 96.45,35.83 P7.2
P8  (via drill 0.35)
  Top 0.406: P8.2 38.55,6.03 v37.35,7.23 | v26.75,34.68 27.55,33.88 27.55,30.83 v28.15,30.23 | v16.75,34.63 v16.75,30.63 | v40.75,29.83 41.95,31.03 v41.95,34.63 | v54.35,29.83 56.15,31.63 v56.15,34.48 | v63.42,30.7 69.95,37.23 v71.75,37.23 | v80.95,34.63 83.75,34.63 v86.55,37.43 | v96.95,34.63 98.95,34.63 v101.75,37.43
  Bottom 0.406: v37.35,7.23 27.55,17.03 27.55,24.23 30.15,26.83 37.75,26.83 39.95,29.03 | 26.43,35.4 PAD2.1 26.43,35 v26.75,34.68 | PAD1.1 16.75,35.33 v16.75,34.63 | v16.75,30.63 18.35,29.03 29.35,29.03 | 29.35,29.03 39.95,29.03 | 39.95,29.03 v40.75,29.83 | v41.95,34.63 PAD3.1 | v28.15,30.23 29.35,29.03 | 39.95,29.03 53.55,29.03 | 53.55,29.03 v54.35,29.83 | v56.15,34.48 56.15,35.63 55.95,35.83 PAD4.1 | 53.55,29.03 61.75,29.03 v63.42,30.7 | PAD5.1 72.25,36.73 v71.75,37.23 74.95,37.23 77.55,34.63 v80.95,34.63 | v86.55,37.43 87.35,37.43 87.75,37.03 87.75,35.93 PAD6.1 88.85,34.63 v96.95,34.63 | v101.75,37.43 102.55,37.43 102.95,37.03 PAD7.1
PE0
  Top 0.152: 100.54,3.11 I/O1.2 99.25,4.37 99.25,7.95 DIR8.1
PE1
  Top 0.152: DIR9.1 106.4,12.18 103.66,12.18 100.57,9.09 100.57,5.59 I/O1.1
PE2  (via drill 0.35)
  Top 0.152: DIR10.1 115.14,12.42 113.75,11.03 111.95,9.23 111.95,7.03 v110.75,5.83
  Bottom 0.152: I/O1.4 99.24,4.23 109.15,4.23 v110.75,5.83
PE3  (via drill 0.35)
  Top 0.152: DIR11.1 132.34,10.27 132.35,10.25 120.15,10.25 117.13,7.23 v113.35,7.23
  Bottom 0.152: I/O1.3 98.04,6.53 98.75,7.23 v113.35,7.23
PE4
  Top 0.152: 135.13,7.83 135.14,7.85 | 135.14,7.85 139.47,12.18 146.03,12.18 DIR12.1 | I/O1.6 96.81,1.73 129.03,1.73 135.14,7.85
  Bottom 0.152: 95.51,3.11 I/O1.6
PE5
  Top 0.152: 146.75,7.22 146.86,7.33 | 146.86,7.33 151.93,12.41 157.84,12.41 DIR13.1 | 146.86,7.33 140.76,1.23 95.15,1.23 94.25,2.13 94.25,4.33 94.26,4.33 I/O1.5
PE6
  Top 0.152: DIR14.1 167.9,12.25 164.44,12.25 152.92,0.73 94.35,0.73 92.96,2.12 I/O1.8
PE7
  Top 0.152: 92.92,5.55 I/O1.7 91.75,4.37 91.75,2.43 90.01,0.69 13.19,0.69 5.48,8.41 DIR1.1
  Top 0.406: R2.2 4.28,10.69 | DIR1.1 5.33,9.65 4.28,10.69 | IO1.1 9.72,33.49 4.28,28.04 4.28,10.69
PE8
  Top 0.152: DIR2.1 19.81,7.97 26.55,1.23 88.75,1.23 90.42,2.91 I/O1.10
  Top 0.406: 17.95,11.08 R4.2 16.67,12.55 | DIR2.1 19.25,9.79 17.98,11.06 17.95,11.08 | IO2.1 17.95,31.54 17.95,11.08
  Bottom 0.152: 90.48,3.11 I/O1.10
PE9
  Top 0.152: DIR3.1 33.18,9.66 33.18,7.73 39.18,1.73 88.45,1.73 89.15,2.43 89.15,4.31 I/O1.9
  Top 0.406: DIR3.1 32.23,9.8 30.87,11.15 | 30.87,11.15 R6.2 | IO3.1 32.68,33.06 30.95,31.33 30.95,13.83 30.95,13.33 30.95,11.23 30.87,11.15
PE10  (via drill 0.35)
  Top 0.152: DIR4.1 45.67,9.66 45.67,7.43 47.95,5.16 47.95,5.14 v48.25,4.83
  Top 0.406: 43.95,10.97 R8.2 42.98,12.37 | DIR4.1 45.12,9.8 44.22,10.7 43.95,10.97 | IO4.1 43.95,31.7 43.95,13.63 43.95,13.33 43.95,10.97
  Bottom 0.152: I/O1.12 87.88,2.17 86.45,0.73 52.35,0.73 v48.25,4.83
PE11
  Top 0.203: DIR5.1 58.48,9.31 59.55,8.23 68.75,8.23 69.75,7.23 82.95,7.23 84.15,6.03 84.15,5.03 84.75,4.43 86.74,4.43 I/O1.11
  Top 0.406: IO5.1 57.1,31.76 57.1,10.47 | R10.2 57.1,10.47 | 57.1,10.47 57.88,9.68 DIR5.1
PE12  (via drill 0.35)
  Top 0.152: 70.67,9.66 DIR6.1 v70.74,8.34 v70.75,8.33
  Top 0.406: IO6.1 68.95,31.5 68.95,11.19 | 67.95,12.33 67.63,12.66 R12.2 68.95,11.19 | 68.95,11.19 70.33,9.81 DIR6.1
  Bottom 0.152: I/O1.14 84.15,4.23 74.45,4.23 70.75,7.93 v70.75,8.33
PE13
  Top 0.152: I/O1.13 85.4,5.63 85.4,6.14 82.66,8.88 82.71,9.63 DIR7.1
  Top 0.406: 80.95,11.39 79.62,12.73 R14.2 80,12.88 | DIR7.1 81.43,10.91 80.95,11.39 | IO7.1 80.95,31.69 80.95,11.39
VIN
  Bottom 1.3: P1.1 P2.1 27.55,33.29 P3.1 P4.1 P5.1 P6.1 | P6.1 P7.1 | I/O1.17 92.95,18.27 92.95,28.29 87.95,33.29 P6.1

### Text on the board
tPlace: + | - | + | - | + | - | + | - | + | - | + | - | + | - | IO1 | IO2 | IO3 | IO4 | IO6 | IO7 | OUT1 | COM1 | OUT2 | COM2 | OUT3 | OUT4 | COM4 | OUT5 | COM5 | OUT6 | COM6 | OUT7 | COM7 | IO5 | COM3